# Altium schematic sheet Hand_Dmx_Tester.SchDoc
size A3
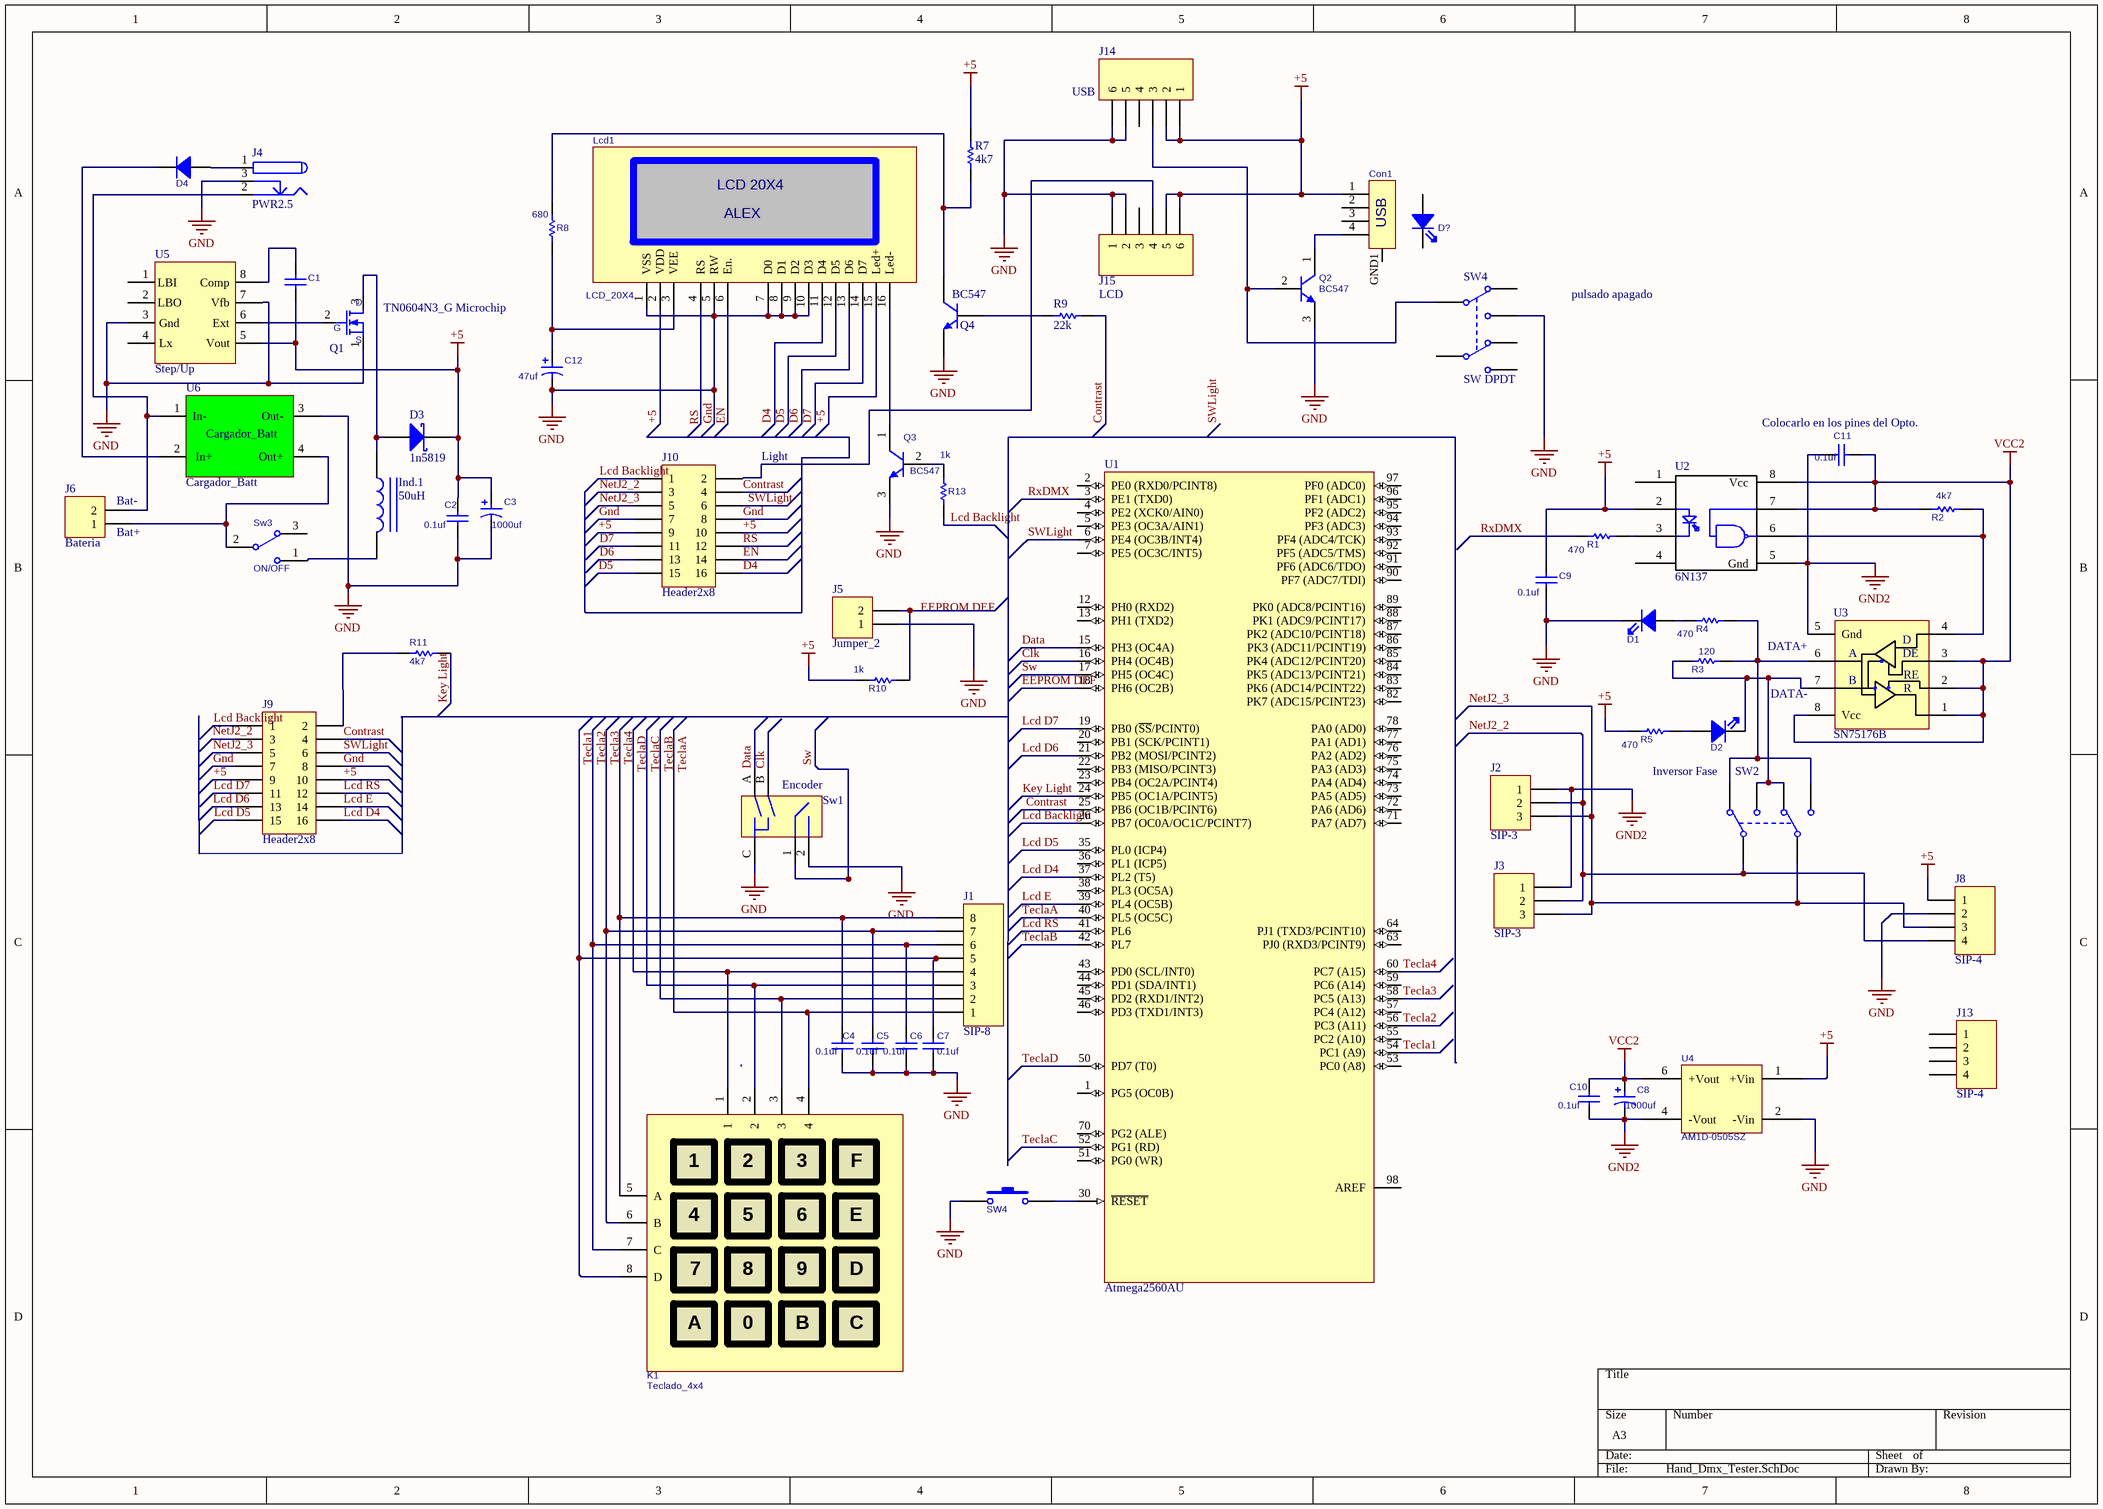
[diagram p0: Hand_Dmx_Tester.SchDoc]

## Parts
(Parts that share a designator on the sheet are numbered #1, #2 ... from top to bottom, then left to right.)
C1  100pf  [Ceramico]  (value not drawn)
C2  0.1uf  [Ceramico]
C3  1000uf  [Cap300]
C4  0.1uf  [Ceramico]
C5  0.1uf  [Ceramico]
C6  0.1uf  [Ceramico]
C7  0.1uf  [Ceramico]
C8  1000uf  [Cap200]
C9  0.1uf  [Ceramico]
C10  0.1uf  [Ceramico]
C11  0.1uf  [Ceramico]
C12  47uf  [Cap100]
Con1  Conector USB  [Conec_Usb_A]  (value not drawn)
D1  Led  [Led3R]  (value not drawn)
D2  Led  [Led3V]  (value not drawn)
D3  1n5819  [DO41-30]
D4  Diodo  [DIODO-4OO7]  (value not drawn)
D?  Led  [Led3R]  (value not drawn)
Ind.1  50uH  [Choque_V]
J1  SIP-8  [SIP-8]
J2  SIP-3  [NC5FAH]
J3  SIP-3  [NC3FBAH2]
J4  PWR2.5  [PWR2.5]
J5  Jumper_2  [Jumper_2]
J6  Bateria  [Reg2]
J8  SIP-4  [SIP-4]
J9  Header2x8  [HEADER2x8]
J10  Header2x8  [Header2x8Ang.]
J13  SIP-4  [SIP-4]
J14  USB  [SIP-6]
J15  LCD  [SIP-6]
K1  Teclado_4x4  [Keypad_4x4_Membrana]
Lcd1  LCD_20X4  [LCD20x4]
Q1  TN0604N3_G Microchip  [VS0104]
Q2  BC547  [TO-92]
Q3  BC547  [TO-92]
Q4  BC547  [TO-92]
R1  470  [470]
R2  4k7  [4k7]
R3  120  [120]
R4  470  [470]
R5  470  [470]
R7  4k7  [4k7]
R8  680  [680]
R9  22k  [22k]
R10  1k  [1k]
R11  4k7  [1k]
R13  1k  [1K_1/4w]
Sw1  Encoder  [Encoder_Gray]
SW2  Inversor Fase  [DPDT]
Sw3  ON/OFF  [Spdt_H]
SW4#1  SW DPDT  [DPDT]
SW4#2  Pulsador  [Pulsador]  (value not drawn)
U1  Atmega2560AU  [Atmega2560]
U2  6N137  [DIP-8]
U3  SN75176B  [DIP-8]
U4  AM1D-0505SZ  [DC/DC Converter]
U5  Step/Up  [DIP-8]
U6  Cargador_Batt  [Carga_Batt]

## Nets
+5: C1.2 C2.1 C3.1 C9.1 Con1.1 D3.2(K) J8.1 J9.9 J9.10 J10.9 J10.10 J14.1 J14.2 J15.5 J15.6 Lcd1.2(VDD) Lcd1.15(Led+) R5.1 R7.2 R10.2 U2.2(A) U4.1(+Vin) U5.5(Vout)
Gnd: C2.2 C3.2 C4.2 C5.2 C6.2 C7.2 C9.2 C12.2 D1.2(K) J4.3 J5.1 J8.2 J9.7 J9.8 J10.7 J10.8 J14.5 J14.6 J15.1 J15.2 Lcd1.1(VSS) Lcd1.5(RW) Lcd1.7(D0) Lcd1.8(D1) Lcd1.9(D2) Lcd1.10(D3) Q1.1(S) Q2.3(E) Q3.3(E) Q4.3(E) Sw1.2 Sw1.C SW4#1.3(NO1) SW4#2.1 U4.2(-Vin) U5.3(Gnd) U5.7(Vfb) U6.3(Out-)
GND2: C8.2 C10.2 C11.1 J2.1 J3.1 U2.5(Gnd) U3.5(Gnd) U4.4(-Vout)
VCC2: C8.1 C10.1 C11.2 R2.1 U2.7 U2.8(Vcc) U3.1(R) U3.2(RE) U3.3(DE) U3.8(Vcc) U4.6(+Vout)
Clk: Sw1.B U1.16(PH4_(OC4B))
Contrast: J9.4 J10.4 R9.2 U1.25(PB6_(OC1B/PCINT6))
D4: J10.16 Lcd1.11(D4)
D5: J10.15 Lcd1.12(D5)
D6: J10.13 Lcd1.13(D6)
D7: J10.11 Lcd1.14(D7)
Data: Sw1.A U1.15(PH3_(OC4A))
EEPROM DEF: U1.18(PH6_(OC2B))
EN: J10.14
Key Light: R11.1 U1.24(PB5_(OC1A/PCINT5))
Lcd Backlight: J9.1 J10.1 R13.1 U1.26(PB7_(OC0A/OC1C/PCINT7))
Lcd D4: J9.16 U1.37(PL2_(T5))
Lcd D5: J9.15 U1.35(PL0_(ICP4))
Lcd D6: J9.13 U1.21(PB2_(MOSI/PCINT2))
Lcd D7: J9.11 U1.19(PB0_(~{SS}/PCINT0))
Lcd E: J9.14 U1.39(PL4_(OC5B))
Lcd RS: J9.12 U1.41(PL6)
NetJ2_2: J2.2 J3.2 J8.4 J9.3 J10.3 SW2.1(COMMON1)
NetJ2_3: J2.3 J3.3 J8.3 J9.5 J10.5 SW2.5(COMMON2)
RS: J10.12
RxDMX: R1.1 U1.3(PE1_(TXD0))
Sw: Sw1.1 U1.17(PH5_(OC4C))
SWLight: J9.6 J10.6 U1.6(PE4_(OC3B/INT4))
Tecla1: C7.1 J1.5 K1.8(D) U1.54(PC1_(A9))
Tecla2: C6.1 J1.6 K1.7(C) U1.56(PC3_(A11))
Tecla3: C5.1 J1.7 K1.6(B) U1.58(PC5_(A13))
Tecla4: C4.1 J1.8 K1.5(A) U1.60(PC7_(A15))
TeclaA: J1.1 K1.4 U1.40(PL5_(OC5C))
TeclaB: J1.2 K1.3 U1.42(PL7)
TeclaC: J1.3 K1.2 U1.52(PG1_(RD))
TeclaD: J1.4 K1.1 U1.50(PD7_(T0))
NetC1_1: C1.1 U5.8(Comp)
NetC12_1: C12.1 Lcd1.3(VEE) R8.1
NetCon1_4: Con1.4 Q2.1(C)
NetD1_1: D1.1(A) R4.1
NetD2_1: D2.1(A) R5.2
NetD2_2: D2.2(K) R3.1 SW2.3(NO1) SW2.4(NC2) U3.7(B)
NetD3_1: D3.1(A) Ind.1.1 Q1.3(D)
NetD4_1: D4.1(A) J4.1
NetD4_2: D4.2(K) U6.2(In+)
NetInd.1_2: Ind.1.2 Sw3.1
NetJ4_2: J4.2 J6.2 U6.1(In-)
NetJ5_2: J5.2 R10.1
NetJ6_1: J6.1 Sw3.2 U6.4(Out+)
NetJ9_2: J9.2 R11.2
NetJ10_2: J10.2 J15.4
NetJ14_3: J14.3 Q2.2(B) SW4#1.1(COMMON1)
NetLcd1_16: Lcd1.16(Led-) Q3.1(C)
NetQ1_2: Q1.2(G) U5.6(Ext)
NetQ3_2: Q3.2(B) R13.2
NetQ4_1: Q4.1(C) R7.1 R8.2
NetQ4_2: Q4.2(B) R9.1
NetR1_2: R1.2 U2.3(K)
NetR2_2: R2.2 U2.6(Out) U3.4(D)
NetR3_2: R3.2 R4.2 SW2.2(NC1) SW2.6(NO2) U3.6(A)
NetSW4#2_2: SW4#2.2 U1.30(~{RESET})

Not connected (* = marked no-connect by the designer): Con1 2 3 GND1; D? 1(A) 2(K); J13 1 2 3 4; J14 4; J15 3; Lcd1 4(RS) 6(En.); Sw3 3; SW4#1 2(NC1) 4(NC2) 5(COMMON2) 6(NO2); U1 1(PG5_(OC0B)) 2(PE0_(RXD0/PCINT8)) 4(PE2_(XCK0/AIN0)) 5(PE3_(OC3A/AIN1)) 7(PE5_(OC3C/INT5)) 12(PH0_(RXD2)) 13(PH1_(TXD2)) 20(PB1_(SCK/PCINT1)) 22(PB3_(MISO/PCINT3)) 23(PB4_(OC2A/PCINT4)) 36(PL1_(ICP5)) 38(PL3_(OC5A)) 43(PD0_(SCL/INT0)) 44(PD1_(SDA/INT1)) 45(PD2_(RXD1/INT2)) 46(PD3_(TXD1/INT3)) 51(PG0_(WR)) 53(PC0_(A8)) 55(PC2_(A10)) 57(PC4_(A12)) 59(PC6_(A14)) 63(PJ0_(RXD3/PCINT9)) 64(PJ1_(TXD3/PCINT10)) 70(PG2_(ALE)) 71(PA7_(AD7)) 72(PA6_(AD6)) 73(PA5_(AD5)) 74(PA4_(AD4)) 75(PA3_(AD3)) 76(PA2_(AD2)) 77(PA1_(AD1)) 78(PA0_(AD0)) 82(PK7_(ADC15/PCINT23)) 83(PK6_(ADC14/PCINT22)) 84(PK5_(ADC13/PCINT21)) 85(PK4_(ADC12/PCINT20)) 86(PK3_(ADC11/PCINT19)) 87(PK2_(ADC10/PCINT18)) 88(PK1_(ADC9/PCINT17)) 89(PK0_(ADC8/PCINT16)) 90(PF7_(ADC7/TDI)) 91(PF6_(ADC6/TDO)) 92(PF5_(ADC5/TMS)) 93(PF4_(ADC4/TCK)) 94(PF3_(ADC3)) 95(PF2_(ADC2)) 96(PF1_(ADC1)) 97(PF0_(ADC0)) 98(AREF); U2 1 4; U5 1(LBI) 2(LBO) 4(Lx)

## Notes on the sheet
- pulsado apagado
- (near C11) Colocarlo en los pines del Opto.
- (near J6) Bat-
- (near J10) Light
- (near J6) Bat+
- DATA+
- DATA-
- Labels drawn without touching a wire or pin: EEPROM DEF, EN, Gnd, RS, SWLight
- (in symbol ConectorUSB) USB
- (in symbol LCD_20X4) LCD 20X4; ALEX
- (in symbol Teclado_4x4) F; E; 9; 0

## Library data of the parts
C1 = ConNpol: Condensador no polarizado; Value: 0.1uf
C2 = ConCeramico: Condensadr cerámico; Valor: 0.1uf
C3 C8 = ConPol: Condensador electrolitico polarizado; Value: 1uf
C4-C7 C9-C11 = ConNpol: Condensador no polarizado; Value: 0.1uf
C12 = ConPol: Condensador electrolitico polarizado; Value: 47uf
Con1 = ConectorUSB
D3 = D_Schottky
D4 = Diodo: Diodo generico
Ind.1 = Choque/mag.
J6 = Reg2
J14 J15 = SIP-6
Q1 = VN0104: Mosfet de microchip
Q2 Q3 = NPN: Transistor NPN
Q4 = NPN: NPN Bipolar Transistor; Published: 8-Jun-2000; LatestRevisionDate: 17-Jul-2002; LatestRevisionNote: Re-released for DXP Platform.; PackageReference: TO-226-AA; Publisher: Altium Limited; PackageDescription: TO, Flat Index; 3 In-Line, Axial Leads; Body Dia. 4.8mm; Leads 0.55 x 0.51 mm (max); Code_JEDEC: TO-226-AA
R1-R5 R8 R10 R11 R13 = Res1: Resistencia
R7 = Res1: Resistor; Value: 1K; Published: 8-Jun-2000; LatestRevisionDate: 17-Jul-2002; LatestRevisionNote: Re-released for DXP Platform.; PackageReference: AXIAL-0.3; Publisher: Altium Limited; PackageDescription: Axial Device, Thru-Hole; 2 Leads; 0.3 in Pin Spacing
R9 = Res1: Resistor; Published: 8-Jun-2000; LatestRevisionDate: 17-Jul-2002; LatestRevisionNote: Re-released for DXP Platform.; PackageReference: AXIAL-0.3; Publisher: Altium Limited; PackageDescription: Axial Device, Thru-Hole; 2 Leads; 0.3 in Pin Spacing; Value: 22k
Sw1 = Encoder_Gray: Encoder Binary de Gray
SW2 = SW DPDT
Sw3 = SPDTV: Conmutador miniatura vertical
SW4#2 = Pulsador: Pulsador miniatura
U2 = OPTO_5
U4 = DC/DC Converter
U5 = Max641/2/3
U6 = Cargador_Batt: Caragador baterias lipo